# Altium project Relay.PrjPcb
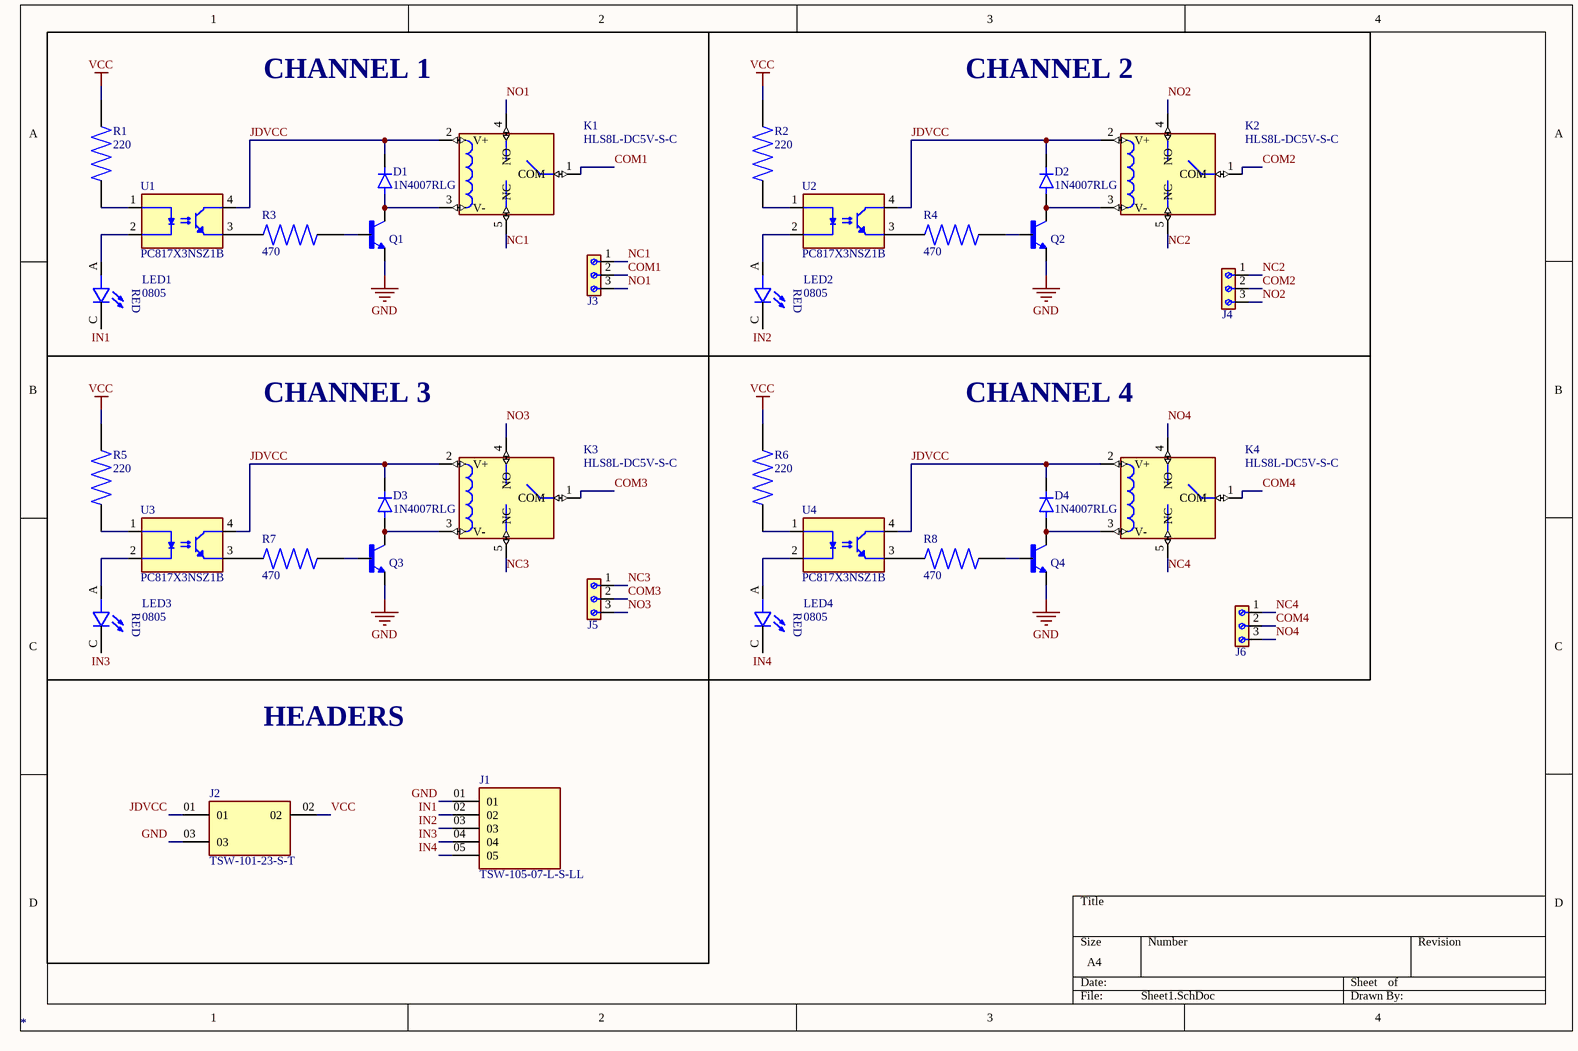
[diagram p0: Sheet1.SchDoc]
1 sheet, 35 parts. Net scope: global (net labels, ports and power ports of the same name join across sheets).
Board file: PCB1.PcbDoc

## Sheet Sheet1.SchDoc
size A4; SheetNumber: 1; SheetTotal: 1

### Parts
(Parts that share a designator on the sheet are numbered #1, #2 ... from top to bottom, then left to right.)
D1  1N4007RLG  [1N4007 - duplicate]
D2  1N4007RLG  [1N4007 - duplicate]
D3  1N4007RLG  [1N4007 - duplicate]
D4  1N4007RLG  [1N4007 - duplicate]
J1  TSW-105-07-L-S-LL  [SAMTEC_TSW-105-07-L-S-LL]
J2  TSW-101-23-S-T  [SAMTEC_TSW-101-23-S-T]
J3  691213710003  [691213710003]  (value not drawn)
J4  691213710003  [691213710003]  (value not drawn)
J5  691213710003  [691213710003]  (value not drawn)
J6  691213710003  [691213710003]  (value not drawn)
K1  HLS8L-DC5V-S-C  [REY5-19.0X15.0X15.0MM]
K2  HLS8L-DC5V-S-C  [REY5-19.0X15.0X15.0MM]
K3  HLS8L-DC5V-S-C  [REY5-19.0X15.0X15.0MM]
K4  HLS8L-DC5V-S-C  [REY5-19.0X15.0X15.0MM]
LED1  0805  [LED_7012X1]
LED2  0805  [LED_7012X1]
LED3  0805  [LED_7012X1]
LED4  0805  [LED_7012X1]
Q1#1  *
Q1#2  MMBT2222A RFG  [SOT95P237X112-3N]  (value not drawn)
Q2  MMBT2222A RFG  [SOT95P237X112-3N]  (value not drawn)
Q3  MMBT2222A RFG  [SOT95P237X112-3N]  (value not drawn)
Q4  MMBT2222A RFG  [SOT95P237X112-3N]  (value not drawn)
R1  220  [RES_ERJB3CFR12V]
R2  220  [RES_ERJB3CFR12V]
R3  470  [RES_ERJB3CFR12V]
R4  470  [RES_ERJB3CFR12V]
R5  220  [RES_ERJB3CFR12V]
R6  220  [RES_ERJB3CFR12V]
R7  470  [RES_ERJB3CFR12V]
R8  470  [RES_ERJB3CFR12V]
U1  PC817X3NSZ1B  [DIP762W50P254L495H455Q4]
U2  PC817X3NSZ1B  [DIP762W50P254L495H455Q4]
U3  PC817X3NSZ1B  [DIP762W50P254L495H455Q4]
U4  PC817X3NSZ1B  [DIP762W50P254L495H455Q4]

### Blocks framed on the sheet
CHANNEL 1: D1 J3 K1 LED1 Q1#1 Q1#2 R1 R3 U1
CHANNEL 2: D2 J4 K2 LED2 Q2 R2 R4 U2
CHANNEL 3: D3 J5 K3 LED3 Q3 R5 R7 U3
CHANNEL 4: D4 J6 K4 LED4 Q4 R6 R8 U4
HEADERS: J1 J2

### Nets
GND: J1.01 J2.03 Q1#2.2(E) Q2.2(E) Q3.2(E) Q4.2(E)
VCC: J2.02 R1.2 R2.2 R5.2 R6.2
COM1: J3.2 K1.1(COM)
COM2: J4.2 K2.1(COM)
COM3: J5.2 K3.1(COM)
COM4: J6.2 K4.1(COM)
IN1: J1.02 LED1.C
IN2: J1.03 LED2.C
IN3: J1.04 LED3.C
IN4: J1.05 LED4.C
JDVCC: D1.C D2.C D3.C D4.C J2.01 K1.2(V+) K2.2(V+) K3.2(V+) K4.2(V+) U1.4(COLLECTOR) U2.4(COLLECTOR) U3.4(COLLECTOR) U4.4(COLLECTOR)
NC1: J3.1 K1.5(NC)
NC2: J4.1 K2.5(NC)
NC3: J5.1 K3.5(NC)
NC4: J6.1 K4.5(NC)
NO1: J3.3 K1.4(NO)
NO2: J4.3 K2.4(NO)
NO3: J5.3 K3.4(NO)
NO4: J6.3 K4.4(NO)
NetD1_A: D1.A K1.3(V-) Q1#2.3(C)
NetD2_A: D2.A K2.3(V-) Q2.3(C)
NetD3_A: D3.A K3.3(V-) Q3.3(C)
NetD4_A: D4.A K4.3(V-) Q4.3(C)
NetLED1_A: LED1.A U1.2(CATHODE)
NetLED2_A: LED2.A U2.2(CATHODE)
NetLED3_A: LED3.A U3.2(CATHODE)
NetLED4_A: LED4.A U4.2(CATHODE)
NetQ1#2_1: Q1#2.1(B) R3.2
NetQ2_1: Q2.1(B) R4.2
NetQ3_1: Q3.1(B) R7.2
NetQ4_1: Q4.1(B) R8.2
NetR1_1: R1.1 U1.1(ANODE)
NetR2_1: R2.1 U2.1(ANODE)
NetR3_1: R3.1 U1.3(EMITTER)
NetR4_1: R4.1 U2.3(EMITTER)
NetR5_1: R5.1 U3.1(ANODE)
NetR6_1: R6.1 U4.1(ANODE)
NetR7_1: R7.1 U3.3(EMITTER)
NetR8_1: R8.1 U4.3(EMITTER)

### Notes on the sheet
- (in symbol 7012X1) RED

### Library data of the parts
D1-D4 = 1N4007RLG: Rectifier Diode Switching 1KV 1A 2-Pin DO-41 T/R; MF: onsemi; SnapEDA_Link: https://www.snapeda.com/parts/1N4007RLG/Onsemi/view-part/?ref=snap; Package: DO-41 onsemi; Value: *; MP: 1N4007RLG; Check_prices: https://www.snapeda.com/parts/1N4007RLG/Onsemi/view-part/?ref=eda
J3-J6 = 691213710003: Serie 213 - 5,0mm pitch - Modular THT - Green - Horizontal cable entry Rising Cage Clamp 10mm height - 03p; MF: Wurth Electronics; SnapEDA_Link: https://www.snapeda.com/parts/691213710003/Wurth+Electronics/view-part/?ref=snap; Package: None; Value: *; MP: 691213710003; Check_prices: https://www.snapeda.com/parts/691213710003/Wurth+Electronics/view-part/?ref=eda
K1-K4 = HLS8L-DC5V-S-C: DIP Power Relay 5V-7A;; MF: Helishun; SnapEDA_Link: https://www.snapeda.com/parts/HLS8L-DC5V-S-C/Helishun/view-part/?ref=snap; Package: None; Value: *; MP: HLS8L-DC5V-S-C; Check_prices: https://www.snapeda.com/parts/HLS8L-DC5V-S-C/Helishun/view-part/?ref=eda
LED1-LED4 = 7012X1: Red - LED Indication - Discrete 1.7V 0805 (2012 Metric); MF: VCC; SnapEDA_Link: https://www.snapeda.com/parts/7012X1/VCC/view-part/?ref=snap; Package: 0805 Visual Communications; Value: *; MP: 7012X1; Check_prices: https://www.snapeda.com/parts/7012X1/VCC/view-part/?ref=eda
Q1#1 = MMBT2222A RFG: SOT-23, 75V, 0.6A, NPN Transistor
Q1#2 Q2-Q4 = MMBT2222A RFG: SOT-23, 75V, 0.6A, NPN Transistor; MF: Taiwan Semiconductor
R1-R8 = ERJ-B3CFR12V: MP: ERJB3CFR12V; Package: None; Price: None; Availability: Unavailable; Value: *
U1-U4 = PC817X3NSZ1B: Optoisolator Transistor Output - 1 Channel 4-DIP; MF: Sharp Microelectronics; SnapEDA_Link: https://www.snapeda.com/parts/PC817X3NSZ1B/Sharp/view-part/?ref=snap; Package: DIP-4 Sharp Microelectronics; Value: *; MP: PC817X3NSZ1B; Check_prices: https://www.snapeda.com/parts/PC817X3NSZ1B/Sharp/view-part/?ref=eda
J1 = TSW-105-07-L-S-LL: Package: None; Price: None; Value: *; MP: TSW-105-07-L-S-LL; Availability: Unavailable
J2 = TSW-101-23-S-T: Package: None; Price: None; Value: *; MP: TSW-101-23-S-T; Availability: Unavailable